# EAGLE design nordic_NRF8001_eval_1_0 (EAGLE 5.11)
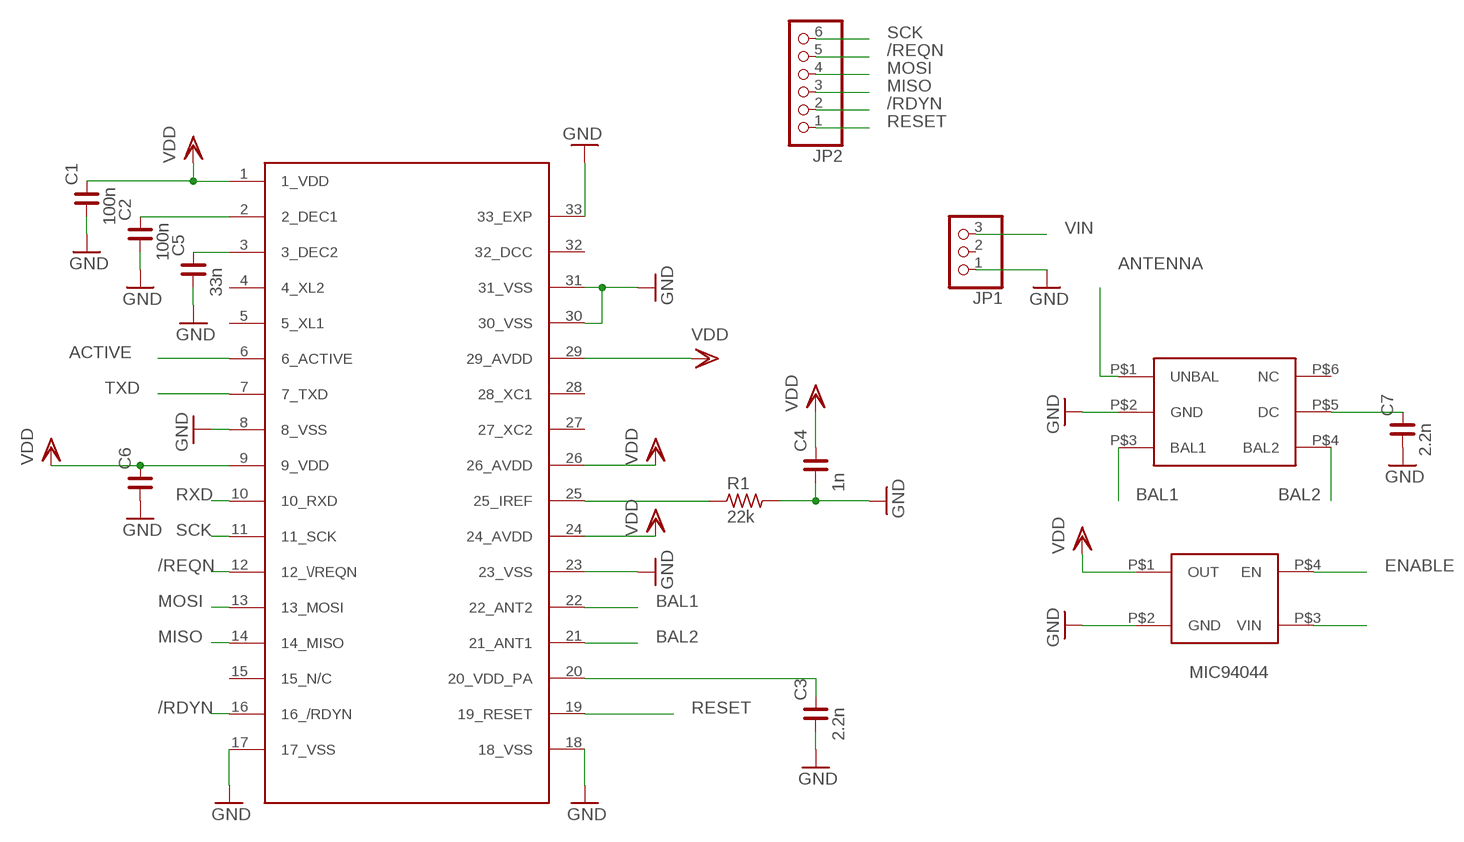
[diagram p0: schematic, sheet 1]

## Parts
C1  100n  C_0402  [C0402]
C2  100n  C_0402  [C0402]
C3  2.2n  C_0402  [C0402]
C4  1n  C_0402  [C0402]
C5  33n  C_0402  [C0402]
C6  C_0402  [C0402]
C7  2.2n  C_0402  [C0402]
JP1  PINHD-1X3  [1X03]
JP2  PINHD-1X6  [1X06]
NORDIC_8001  NRF8001  [QFN32]
R1  22k  R_0402  [R0402]
U$2  BALUN_NRF8001  [BALUNNORDIC]
U$3  MIC94044  [MIC94045YFL_FOOTPRINT]

## Nets
/RDYN: JP2.2 NORDIC_8001.16(16_/RDYN)
/REQN: JP2.5 NORDIC_8001.12(12_\/REQN)
ACTIVE: NORDIC_8001.6(6_ACTIVE)
ANTENNA: U$2.P$1(UNBAL)
BAL1: NORDIC_8001.22(22_ANT2) U$2.P$3(BAL1)
BAL2: NORDIC_8001.21(21_ANT1) U$2.P$4(BAL2)
DC: C3.2 NORDIC_8001.20(20_VDD_PA)
ENABLE: U$3.P$4(EN)
GND: C1.1 C2.1 C3.1 C4.1 C5.1 C6.1 C7.1 JP1.1 NORDIC_8001.8(8_VSS) NORDIC_8001.17(17_VSS) NORDIC_8001.18(18_VSS) NORDIC_8001.23(23_VSS) NORDIC_8001.30(30_VSS) NORDIC_8001.31(31_VSS) NORDIC_8001.33(33_EXP) R1.2 U$2.P$2(GND) U$3.P$2(GND)
MISO: JP2.3 NORDIC_8001.14(14_MISO)
MOSI: JP2.4 NORDIC_8001.13(13_MOSI)
N$1: C2.2 NORDIC_8001.2(2_DEC1)
N$2: C5.2 NORDIC_8001.3(3_DEC2)
N$3: NORDIC_8001.25(25_IREF) R1.1
N$4: C7.2 U$2.P$5(DC)
RESET: JP2.1 NORDIC_8001.19(19_RESET)
RXD: NORDIC_8001.10(10_RXD)
SCK: JP2.6 NORDIC_8001.11(11_SCK)
TXD: NORDIC_8001.7(7_TXD)
VDD: C1.2 C4.2 C6.2 NORDIC_8001.1(1_VDD) NORDIC_8001.9(9_VDD) NORDIC_8001.24(24_AVDD) NORDIC_8001.26(26_AVDD) NORDIC_8001.29(29_AVDD) U$3.P$1(OUT)
VIN: JP1.3 U$3.P$3(VIN)
Unconnected: JP1.2 NORDIC_8001.4(4_XL2) NORDIC_8001.5(5_XL1) NORDIC_8001.15(15_N/C) NORDIC_8001.27(27_XC2) NORDIC_8001.28(28_XC1) NORDIC_8001.32(32_DCC) U$2.P$6(NC)

## Library data of the parts
C1-C7 = rc-master-smd:C_: NON-POLARIZED CAP
JP1 = pinhead:PINHD-1X3: PIN HEADER
JP2 = pinhead:PINHD-1X6: PIN HEADER
NORDIC_8001 = NORDIC8001:NRF8001
R1 = rc-master-smd:R_: RESISTOR
U$2 = 24550BM15A0002_balunNRF8001:BALUN_NRF8001
U$3 = MIC94045YFL:MIC94044

## Board
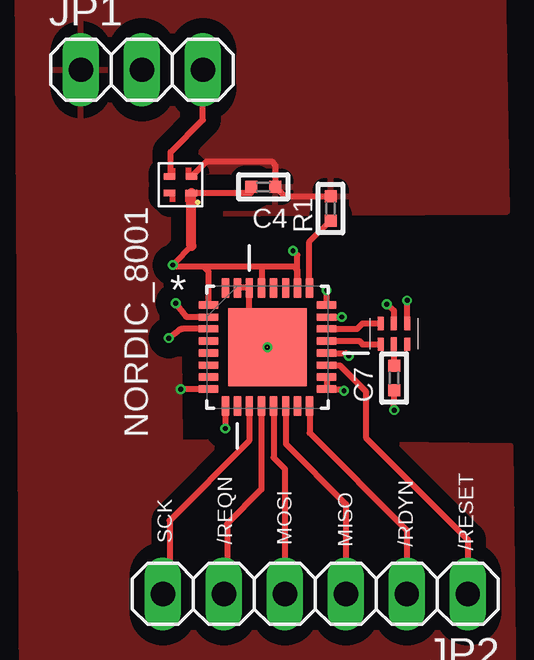
[diagram p1: board, top side]
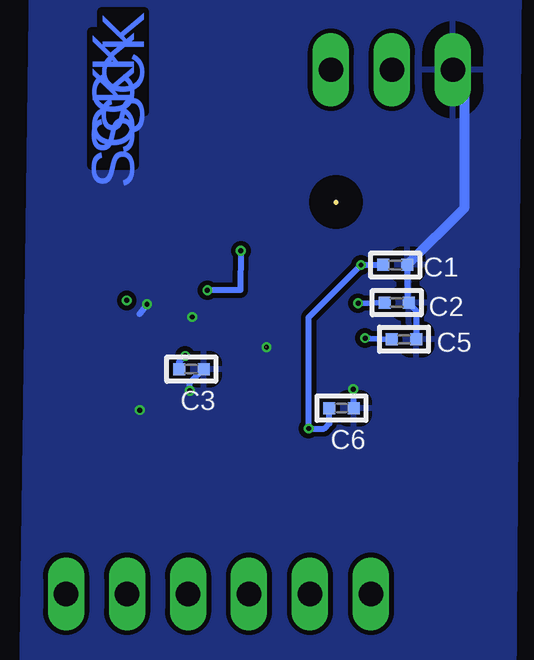
[diagram p2: board, bottom side, seen from below]

Size 0.11 x 0.11 mm. Coordinates in mm from the lower left corner, seen from the top.
Copper layers (1*16): Top 0.035mm / dielectric 1.5mm / Bottom 0.035mm
Design rules "default": minimum track width 5mil, minimum drill 5mil, track to track 6mil, track to pad 6mil, pad to pad 6mil, via to via 6mil, smd to smd 0mil, copper to edge 40mil, drill to drill 8mil, minimum pad ring 3mil, minimum via ring 3mil, stop-mask expansion 4mil, vias tented up to drill 0mil, thermal gap 20mil

### Footprints (pad centres in the part's own frame; a part is rotated, then mirrored left to right if it is on the bottom)
C0402 = smd 0.5 x 0.5: 1 -0.508,0; 2 0.508,0
1X03 = drill 1.016 long: 1 -2.54,0; 2 0,0; 3 2.54,0
1X06 = drill 1.016 long: 1 -6.35,0; 2 -3.81,0; 3 -1.27,0; 4 1.27,0; 5 3.81,0; 6 6.35,0
QFN32 = smd 0.813 x 0.305: 1 -2.464,1.753; 2 -2.464,1.245; 3 -2.464,0.762; 4 -2.464,0.254; 5 -2.464,-0.254; 6 -2.464,-0.762; 7 -2.464,-1.245; 8 -2.464,-1.753; 17 2.464,-1.753; 18 2.464,-1.245; 19 2.464,-0.762; 20 2.464,-0.254; 21 2.464,0.254; 22 2.464,0.762; 23 2.464,1.245; 24 2.464,1.753 | smd 0.305 x 0.813: 9 -1.753,-2.464; 10 -1.245,-2.464; 11 -0.762,-2.464; 12 -0.254,-2.464; 13 0.254,-2.464; 14 0.762,-2.464; 15 1.245,-2.464; 16 1.753,-2.464; 25 1.753,2.464; 26 1.245,2.464; 27 0.762,2.464; 28 0.254,2.464; 29 -0.254,2.464; 30 -0.762,2.464; 31 -1.245,2.464; 32 -1.753,2.464 | smd 3.251 x 3.251: 33 0,0
R0402 = smd 0.5 x 0.5: 1 -0.508,0; 2 0.508,0
BALUNNORDIC = smd 0.55 x 0.25: P$1 -0.432,0.553; P$2 -0.427,0; P$3 -0.432,-0.55; P$4 0.432,-0.55; P$5 0.426,0; P$6 0.432,0.55
MIC94045YFL_FOOTPRINT = smd 0.26 x 0.49: P$1 -0.341,-0.453; P$2 0.342,-0.454; P$3 0.342,0.457; P$4 -0.34,0.454

### Placement (x,y rotation side)
C1  -2.42,-2.57 180 bottom
C2  -2.48,-4.14 180 bottom  (outside the outline)
C3  6.08,-6.91 180 bottom  (outside the outline)
C4  2.78,0.68 180 top
C5  -2.78,-5.66 180 bottom  (outside the outline)
C6  -0.18,-8.53 180 bottom  (outside the outline)
C7  8.23,-7.28 90 top  (outside the outline)
JP1  -2.28,5.56 0 top  (outside the outline)
JP2  4.95,-16.27 180 top  (outside the outline)
NORDIC_8001  2.95,-5.99 0 top  (outside the outline)
R1  5.58,-0.21 90 top  (outside the outline)
U$2  8.22,-5.44 270 top  (outside the outline)
U$3  -0.67,0.77 90 top

### Tracks (layer width: path | path; a pad name or v marks a point on that pad's centre or on a via)
/RDYN
  Top 0.254: NORDIC_8001.16 4.71,-9.57 8.76,-13.62 JP2.2
/REQN
  Top 0.254: JP2.5 1.27,-16.14 1.27,-13.35 2.7,-11.92 NORDIC_8001.12
ANTENNA  (via drill 0.2 pad 0.41)
  Top 0.254: U$2.P$1 v8.77,-4.05
BAL1
  Top 0.254: NORDIC_8001.22 6.69,-5.23 6.92,-5 U$2.P$3
BAL2
  Top 0.254: NORDIC_8001.21 6.77,-5.73 6.92,-5.88 7.66,-5.88 U$2.P$4
DC  (via drill 0.2 pad 0.41)
  Top 0.254: NORDIC_8001.20 6.22,-6.24 v6.34,-6.36
  Bottom 0.254: v6.34,-6.36 6.59,-6.61 C3.2
GND  (via drill 0.2 pad 0.41)  (1 unrouted)
  Top 0.254: v7.93,-4.2 8.22,-4.47 U$2.P$2 | NORDIC_8001.23 v6.04,-4.74 | v6.14,-7.81 6.07,-7.74 NORDIC_8001.17 NORDIC_8001.18 | C7.1 8.22,-8.57 v8.23,-8.62 | v-0.66,-7.75 v-0.66,-7.74 NORDIC_8001.8 | NORDIC_8001.31 NORDIC_8001.30 2.2,-3.78 2.2,-5.46 2.96,-5.97 NORDIC_8001.33 | U$3.P$2 0.42,1.75 3.12,1.75 3.29,1.59 C4.1 3.68,0.29 R1.2
  Bottom 0.254: v7.93,-4.2 8.23,-4.61 | C3.1 6.14,-7.48 v6.14,-7.81 | C6.1 -0.66,-8.51 v-0.66,-7.75 | C2.1 -3.06,-4.22 -3.06,-4.25 | -3.06,-4.25 -2.93,-4.11 C1.1 | -3.06,-4.25 -3.28,-4.47 C5.1
  Bottom 0.406: C1.1 -5.28,-0.21 -5.28,5.1 JP1.1
  other vias: 2.95,-6
  pour Bottom (isolate 0.2): -7.33,-20.21 13.12,-20.05 12.7,9.37 -7.57,9.45
  pour Top (isolate 0.635): -7.47,9.46 -7.28,-20.25 13.22,-20.17 13.09,-10.12 -0.69,-9.95 -0.79,-0.43 12.94,-0.35 12.78,9.28
MISO
  Top 0.254: JP2.3 6.22,-12.53 3.72,-10.03 NORDIC_8001.14 | NORDIC_8001.14
MOSI
  Top 0.254: NORDIC_8001.13 3.21,-10.6 3.68,-11.07 JP2.4
N$1  (via drill 0.2 pad 0.41)
  Top 0.254: v-0.87,-4.16 -0.41,-4.74 NORDIC_8001.2
  Bottom 0.254: C2.2 -1.99,-4.13 v-0.87,-4.16
N$2  (via drill 0.2 pad 0.41)
  Top 0.254: v-1.16,-5.62 -0.7,-5.27 -0.6,-5.23 NORDIC_8001.3
  Bottom 0.254: C5.2 -1.35,-5.62 v-1.16,-5.62
N$3
  Top 0.254: NORDIC_8001.25 4.7,-1.6 R1.1
N$4
  Top 0.254: C7.2 8.23,-5.94 U$2.P$5
RESET
  Top 0.254: NORDIC_8001.19 5.43,-6.76 5.97,-6.76 7.05,-7.84 7.05,-9.77 11.3,-14.01 JP2.1
SCK
  Top 0.254: JP2.6 -1.13,-16 -1.13,-13.22 2.19,-9.9 NORDIC_8001.11
VDD  (via drill 0.2 pad 0.41)
  Top 0.254: NORDIC_8001.9 1.19,-8.46 v1.19,-9.38 | 0.28,-4.23 NORDIC_8001.1 0.49,-2.84 0.28,-2.62 | NORDIC_8001.29 2.72,-3.51 2.72,-2.69 2.79,-2.62 | 2.79,-2.62 4.04,-2.62 4.2,-2.78 NORDIC_8001.26 4.2,-2.16 v4.02,-1.98 | NORDIC_8001.24 5.37,-4.19 5.41,-4.2 v5.41,-3.62 | v-0.99,-2.57 -0.94,-2.62 | -0.94,-2.62 0.28,-2.62 | 0.28,-2.62 2.79,-2.62 | U$3.P$1 2.27,0.43 C4.2 | -0.94,-2.62 -0.94,-2.49 -0.22,-1.77
  Top 0.406: U$3.P$1 -0.22,-1.77 -0.2,-1.78
  Bottom 0.254: C6.2 0.33,-9.17 0.55,-9.39 1.18,-9.39 v1.19,-9.38 1.19,-4.75 v-0.99,-2.57 C1.2 | v4.02,-1.98 4.03,-3.62 v5.41,-3.62
VIN
  Top 0.254: U$3.P$3 -1.08,1.16 -1.08,2.13 0.26,3.48 JP1.3

### Text on the board
Bottom: SCK | SCK | SCK
tNames: SCK | /REQN | MOSI | MISO | /RDYN | /RESET